# Altium project Nano2.PrjPCB
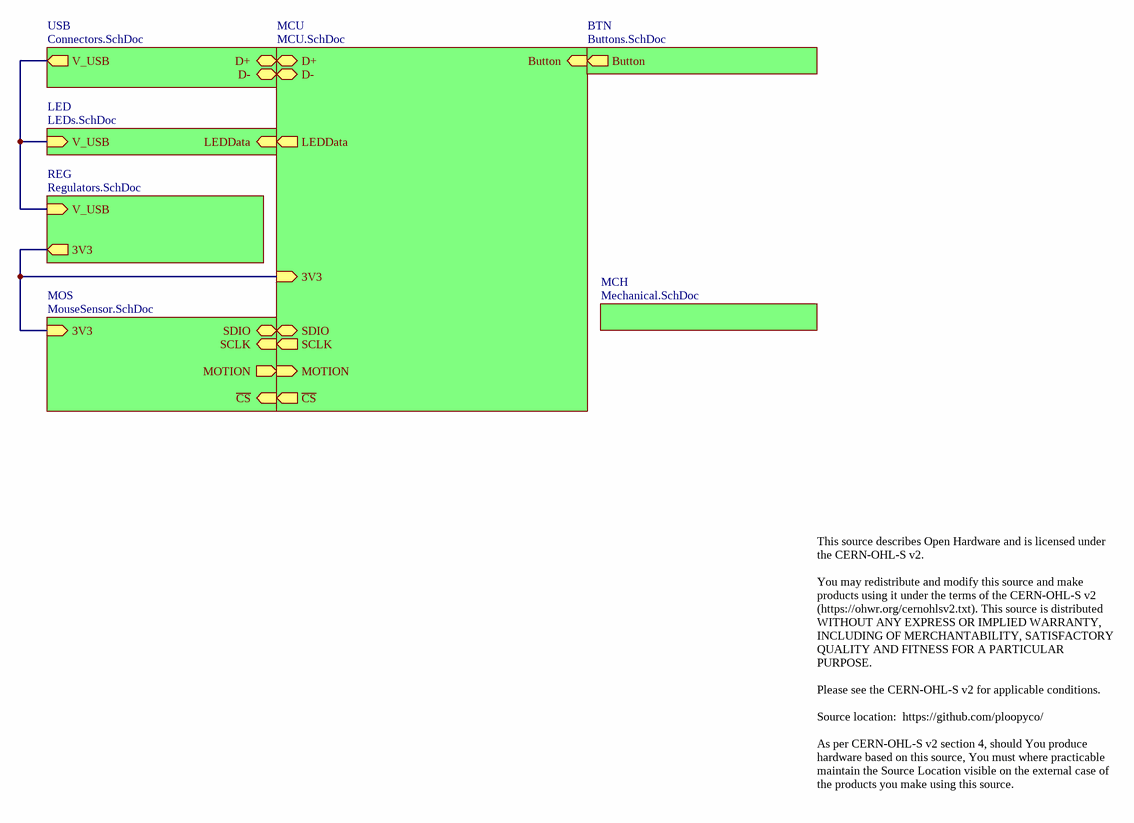
[diagram p0: Nano2.SchDoc]
8 sheets, 60 parts. Net scope: hierarchical (ports join the sheet entries above them; power ports are global).
Board files: Nano2.PcbDoc, Nano2SolderStencil.PcbDoc, Nano2Panel.PcbDoc
Sheets:
  Nano2.SchDoc
    USB = Connectors.SchDoc
    LED = LEDs.SchDoc
    REG = Regulators.SchDoc
    MOS = MouseSensor.SchDoc
    MCU = MCU.SchDoc
    BTN = Buttons.SchDoc
    MCH = Mechanical.SchDoc

## Sheet Nano2.SchDoc
size Letter; CompanyName: Ploopy Corporation; Organization: Ploopy Corporation; Address1: 137-1140 Burnhamthorpe Road W; Address2: Mississauga; Address3: Ontario; Address4: Canada L5C 0A3; DocumentNumber: 1; Revision: R2.003; SheetNumber: 1; SheetTotal: 8

### Sub-sheets
BTN = Buttons.SchDoc: Button (out)
LED = LEDs.SchDoc: V_USB (in), LEDData (in)
MCH = Mechanical.SchDoc: no entries
MCU = MCU.SchDoc: D+ (bidir), D- (bidir), Button (in), LEDData (out), 3V3 (in), SDIO (bidir), SCLK (out), ~{CS} (out), MOTION (in)
MOS = MouseSensor.SchDoc: 3V3 (in), ~{CS} (in), SDIO (bidir), SCLK (in), MOTION (out)
REG = Regulators.SchDoc: 3V3 (out), V_USB (in)
USB = Connectors.SchDoc: D+ (bidir), V_USB (out), D- (bidir)

### Nets
3V3: sheet REG/3V3, sheet MOS/3V3, sheet MCU/3V3
LEDData: sheet LED/LEDData, sheet MCU/LEDData
V_USB: sheet USB/V_USB, sheet LED/V_USB, sheet REG/V_USB
NetR3_2: sheet MOS/SDIO, sheet MCU/SDIO
NetR6_2: sheet USB/D-, sheet MCU/D-
NetR7_2: sheet USB/D+, sheet MCU/D+
NetSW1_A: sheet MCU/Button, sheet BTN/Button
NetU2_A3: sheet MOS/~{CS}, sheet MCU/~{CS}
NetU2_B2: sheet MOS/MOTION, sheet MCU/MOTION
NetU2_D2: sheet MOS/SCLK, sheet MCU/SCLK

### Notes on the sheet
- This source describes Open Hardware and is licensed under the CERN-OHL-S v2.
  You may redistribute and modify this source and make products using it under the terms of the CERN-OHL-S v2 (https://ohwr.org/cernohlsv2.txt). This source is distributed WITHOUT ANY EXPRESS OR IMPLIED WARRANTY, INCLUDING OF MERCHANTABILITY, SATISFACTORY QUALITY AND FITNESS FOR A PARTICULAR PURPOSE.
  Please see the CERN-OHL-S v2 for applicable conditions.
  Source location:  https://github.com/ploopyco/
  As per CERN-OHL-S v2 section 4, should You produce hardware based on this source, You must where practicable maintain the Source Location visible on the external case of the products you make using this source.
- Copyright Ploopy Corporation 2024
- Licensed under the CERN-OHL-S v2
- http://ohwr.org/cernohl
- Title:
- PCB:
- Version:
- Ploopy Corporation
- Mississauga ON L5C 0A3
- 137-1140 Burnhamthorpe Road W
- Date:
- Time:
- Sheet
- of
- Canada

## Sheet Connectors.SchDoc
size Letter; CompanyName: Ploopy Corporation; Organization: Ploopy Corporation; Address1: 137-1140 Burnhamthorpe Road W; Address2: Mississauga; Address3: Ontario; Address4: Canada L5C 0A3; DocumentNumber: 3; Revision: R2.003; SheetNumber: 3; SheetTotal: 8
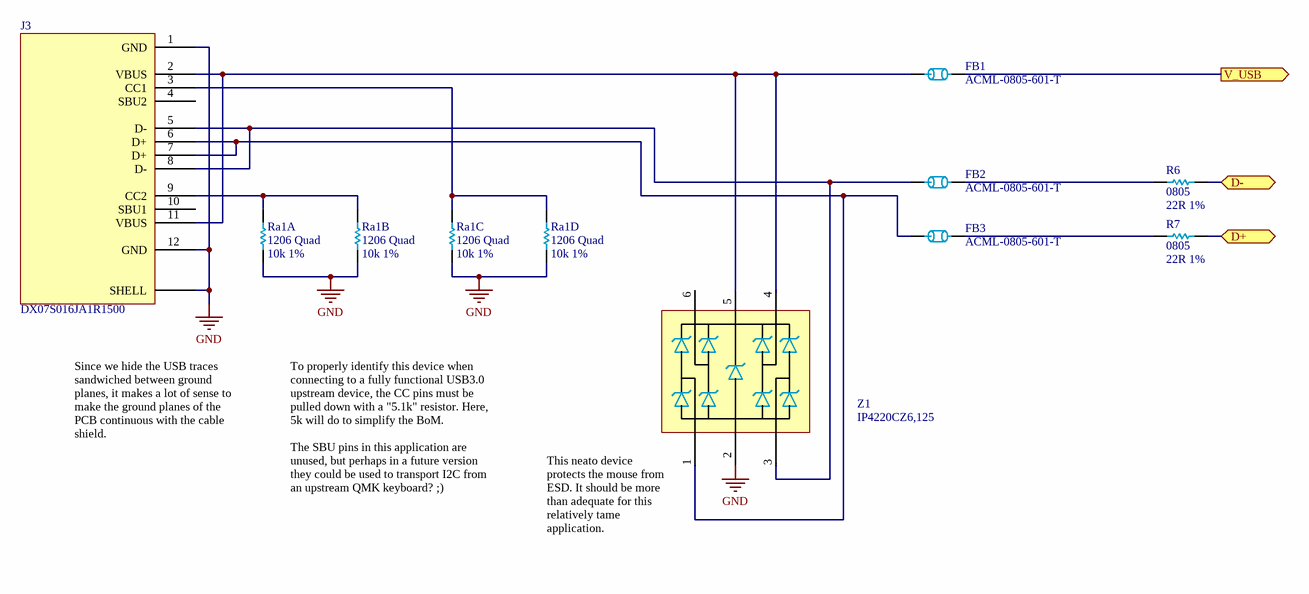
[diagram p1: Connectors.SchDoc]

### Parts
FB1  ACML-0805-601-T  [0805]
FB2  ACML-0805-601-T  [0805]
FB3  ACML-0805-601-T  [0805]
J3  DX07S016JA1R1500  [DX07S016JA1R1500]
R6  0805  value 22R 1%  [0805]
R7  0805  value 22R 1%  [0805]
Ra1  1206 Quad  value 10k 1%  [4x 10k 1% - CAC-80P320X160-8M]  (parts A,B,C,D of 4)
Z1  IP4220CZ6,125  [PESD3V3S4UD - SOT95P275X110-6N]

### Ports
D+ (bidir), D- (bidir), V_USB (out)

### Nets
GND: J3.1(GND) J3.12(GND) J3.SHELL Ra1.1 Ra1.2 Ra1.3 Ra1.4 Z1.2
V_USB: FB1.2 ; port V_USB
NetFB1_1: FB1.1 J3.2(VBUS) J3.11(VBUS) Z1.4 Z1.5
NetFB2_1: FB2.1 J3.5(D-) J3.8(D-) Z1.3
NetFB2_2: FB2.2 R6.1
NetFB3_1: FB3.1 J3.6(D+) J3.7(D+) Z1.1
NetFB3_2: FB3.2 R7.1
NetJ3_3: J3.3(CC1) Ra1.5 Ra1.6
NetJ3_9: J3.9(CC2) Ra1.7 Ra1.8
NetR6_2: R6.2 ; port D-
NetR7_2: R7.2 ; port D+

Not connected (* = marked no-connect by the designer): J3 4(SBU2) 10(SBU1); Z1 6

### Notes on the sheet
- Since we hide the USB traces sandwiched between ground planes, it makes a lot of sense to make the ground planes of the PCB continuous with the cable shield.
- To properly identify this device when connecting to a fully functional USB3.0 upstream device, the CC pins must be pulled down with a "5.1k" resistor. Here, 5k will do to simplify the BoM.
  The SBU pins in this application are unused, but perhaps in a future version they could be used to transport I2C from an upstream QMK keyboard? ;)
- (near Z1) This neato device protects the mouse from ESD. It should be more than adequate for this relatively tame application.
- Copyright Ploopy Corporation 2024
- Licensed under the CERN-OHL-S v2
- http://ohwr.org/cernohl
- Title:
- PCB:
- Version:
- Ploopy Corporation
- Mississauga ON L5C 0A3
- 137-1140 Burnhamthorpe Road W
- Date:
- Time:
- Sheet
- of
- Canada

### Library data of the parts
FB1-FB3 = ACML-0805-601-T: FERRITE BEAD 600 OHM 0805 1LN; PNP-Nzl: 2; PNP-dx: 0; PNP-X: 2.00; PNP-Y: 1.25; PNP-Thk: 0.55; PNP-Lv: 1; PNP-TS: 70; PNP-Type: chi; PNP-FeedType: Tape; PNP-TapeWidth: 8; PNP-dy: 0; PNP-Pt: 0; PNP-W: 0; PNP-Level: 1; PNP-Voff: 0; PNP-PlacePriority: 1; PNP-A: 0; PNP-TapeIndex: 1; PNP-da: 0; Supplier 1: Digi-Key; Supplier Part Number 1: 535-12556-1-ND
J3 = DX07S016JA1R1500: USB-C (USB TYPE-C) USB 2.0 Receptacle Connector 24 (16+8 Dummy) Position Surface Mount, Right Angle; Through Hole; Supplier 1: Digi-Key; Supplier 2: Mouser; Supplier Part Number 1: 670-DX07S016JA1R1500CT-ND; Supplier Part Number 2: 656-DX07S016JA1R1500
R6 R7 = Res 22R 1% 0805: Chip resistor; PNP-Nzl: 2; PNP-dx: 0; PNP-X: 2.00; PNP-Y: 1.25; PNP-Thk: 0.55; PNP-Lv: 1; PNP-TS: 70; PNP-Type: chi; PNP-FeedType: Tape; PNP-TapeWidth: 8; PNP-dy: 0; PNP-Pt: 0; PNP-W: 0; PNP-Level: 1; PNP-Voff: 0; PNP-PlacePriority: 1; PNP-A: 0; PNP-TapeIndex: 1; PNP-da: 0; Supplier 1: Digi-Key; Supplier 2: Arrow; Supplier Part Number 1: RMCF0805FT22R0CT-ND; Supplier Part Number 2: RMCF0805FT22R0
Ra1 = Quad Res 10k 1% 1206: Chip resistor
Z1 = IP4220CZ6,125: TVS DIODE 5.5V 6TSOP (Low capacitance, USB); PNP-Nzl: 2; PNP-dx: 0; PNP-X: 2.9; PNP-Y: 1.3; PNP-A: 270; PNP-Thk: 1; PNP-Lv: 26; PNP-TS: 90; PNP-Type: CHP; PNP-FeedType: Tape; PNP-TapeWidth: 8; PNP-PlacePriority: 3; PNP-dy: 0; PNP-Pt: 0; PNP-W: 0; PNP-Level: 1; PNP-Voff: 0; PNP-TapeIndex: 1; PNP-da: 0

## Sheet LEDs.SchDoc
size Letter; CompanyName: Ploopy Corporation; Organization: Ploopy Corporation; Address1: 137-1140 Burnhamthorpe Road W; Address2: Mississauga; Address3: Ontario; Address4: Canada L5C 0A3; DocumentNumber: 4; Revision: R2.003; SheetNumber: 4; SheetTotal: 8
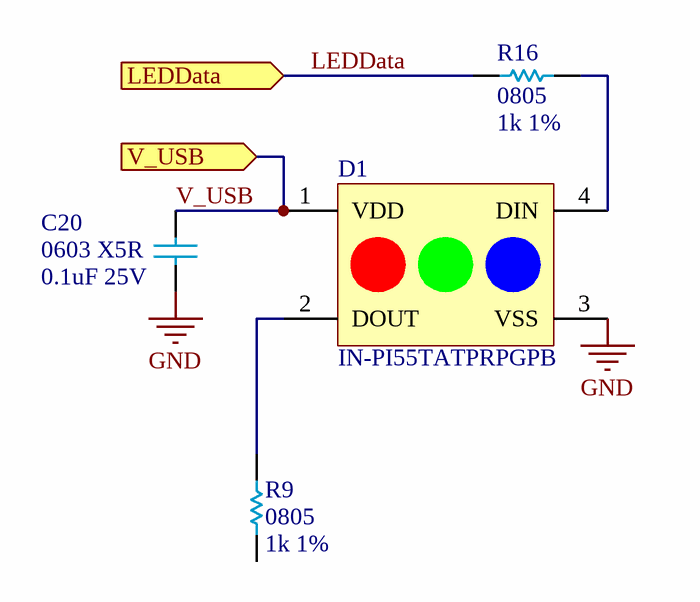
[diagram p2: LEDs.SchDoc]

### Parts
C20  0603 X5R  value 0.1uF 25V  [0603 capacitor - CAPC1608X06N]
D1  IN-PI55TATPRPGPB  [IN-PI55TATPRPGPB]
R9  0805  value 1k 1%  [0805]
R16  0805  value 1k 1%  [0805]

### Ports
LEDData (in), V_USB (in)

### Nets
GND: C20.1 D1.3(VSS)
LEDData: R16.2 ; port LEDData
V_USB: C20.2 D1.1(VDD) ; port V_USB
NetD1_2: D1.2(DOUT) R9.2
NetD1_4: D1.4(DIN) R16.1

Not connected (* = marked no-connect by the designer): R9 1

### Notes on the sheet
- Copyright Ploopy Corporation 2024
- Licensed under the CERN-OHL-S v2
- http://ohwr.org/cernohl
- Title:
- PCB:
- Version:
- Ploopy Corporation
- Mississauga ON L5C 0A3
- 137-1140 Burnhamthorpe Road W
- Date:
- Time:
- Sheet
- of
- Canada

### Library data of the parts
C20 = Cap 0.1uF 25V: 0603, X5R or better; Supplier 1: Digi-Key; Supplier Part Number 1: 1276-6840-2-ND
D1 = IN-PI55TATPRPGPB: ADDRESS LED DISCRETE SERIAL RGB; Supplier 1: Digi-Key; Supplier 2: Arrow; Supplier 3: Mouser; Supplier Part Number 1: 1830-1204-1-ND; Supplier Part Number 2: IN-PI55TATPRPGPB; Supplier Part Number 3: 743-IN-PI55TATPRPGPB
R9 R16 = Res 1k 1% 0805: Chip resistor, 1/8W 100PPM; Supplier 1: Digi-Key; Supplier Part Number 1: RMCF0805FT1K00TR-ND

## Sheet Regulators.SchDoc
size Letter; CompanyName: Ploopy Corporation; Organization: Ploopy Corporation; Address1: 137-1140 Burnhamthorpe Road W; Address2: Mississauga; Address3: Ontario; Address4: Canada L5C 0A3; DocumentNumber: 8; Revision: R2.003; SheetNumber: 8; SheetTotal: 8
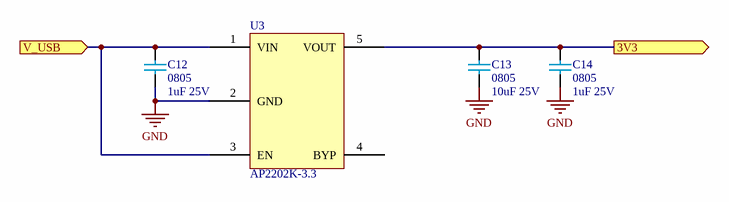
[diagram p3: Regulators.SchDoc]

### Parts
C12  0805  value 1uF 25V  [0805]
C13  0805  value 10uF 25V  [0805]
C14  0805  value 1uF 25V  [0805]
U3  AP2202K-3.3  [AP2202 - SOT95P270X145-5N]

### Ports
3V3 (out), V_USB (in)

### Nets
GND: C12.1 C13.1 C14.1 U3.2(GND)
3V3: C13.2 C14.2 U3.5(VOUT) ; port 3V3
V_USB: C12.2 U3.1(VIN) U3.3(EN) ; port V_USB

Not connected (* = marked no-connect by the designer): U3 4(BYP)

### Notes on the sheet
- Copyright Ploopy Corporation 2024
- Licensed under the CERN-OHL-S v2
- http://ohwr.org/cernohl
- Title:
- PCB:
- Version:
- Ploopy Corporation
- Mississauga ON L5C 0A3
- 137-1140 Burnhamthorpe Road W
- Date:
- Time:
- Sheet
- of
- Canada

### Library data of the parts
C12 C14 = Cap 1uF 25V: 0805, X5R or better; PNP-Nzl: 2; PNP-dx: 0; PNP-Level: 1; PNP-Thk: 1.25; PNP-TS: 70; PNP-Type: chi; PNP-X: 2.00; PNP-FeedType: Tape; PNP-TapeWidth: 8; Supplier 1: Digi-Key; Supplier Part Number 1: 1276-1066-2-ND; Supplier 2: Digi-Key; Supplier Part Number 2: 1276-1066-1-ND; PNP-dy: 0; PNP-Lv: 1; PNP-Pt: 0; PNP-Voff: 0; PNP-W: 0; PNP-Y: 1.25; PNP-A: 0; PNP-PlacePriority: 1; PNP-TapeIndex: 1; PNP-da: 0
C13 = Cap 10uF 25V: 0805, X5R or better; PNP-Nzl: 2; PNP-dx: 0; PNP-X: 2.00; PNP-Y: 1.25; PNP-Lv: 1; PNP-TS: 70; PNP-Type: chi; PNP-FeedType: Tape; PNP-TapeWidth: 8; PNP-dy: 0; PNP-Pt: 0; PNP-W: 0; PNP-Thk: 1.25; PNP-Level: 1; PNP-Voff: 0; PNP-PlacePriority: 1; PNP-A: 0; PNP-TapeIndex: 1; Supplier 1: Mouser; Supplier Part Number 1: 81-GRM21BR61E106KA3L; Supplier 2: Digi-Key; Supplier Part Number 2: 490-5523-1-ND; PNP-da: 0
U3 = AP2202K-3.3: 3.3V 150mA LDO regulator; PNP-Nzl: 2; PNP-dx: 0; PNP-X: 2.9; PNP-Y: 1.3; PNP-A: 90; PNP-Thk: 1; PNP-Lv: 26; PNP-Type: CHP; PNP-FeedType: Tape; PNP-TapeWidth: 8; PNP-PlacePriority: 3; PNP-dy: 0; PNP-Pt: 0; PNP-W: 0; PNP-TS: 90; PNP-Level: 1; PNP-Voff: 0; PNP-TapeIndex: 1; Supplier 1: Mouser; Supplier Part Number 1: 621-AP2202K-3.3TRG1; Supplier 2: Digi-Key; Supplier Part Number 2: AP2202K-3.3TRG1DICT-ND; Supplier 3: Arrow; Supplier Part Number 3: PWagzdsTFFHKE_U17B45SP-NtndBrheJIaI5hB7gHD0ZVywxIBNyoAQstvnyfZZ0; PNP-da: 0

## Sheet MouseSensor.SchDoc
size Letter; CompanyName: Ploopy Corporation; Organization: Ploopy Corporation; Address1: 137-1140 Burnhamthorpe Road W; Address2: Mississauga; Address3: Ontario; Address4: Canada L5C 0A3; DocumentNumber: 7; Revision: R2.003; SheetNumber: 7; SheetTotal: 8
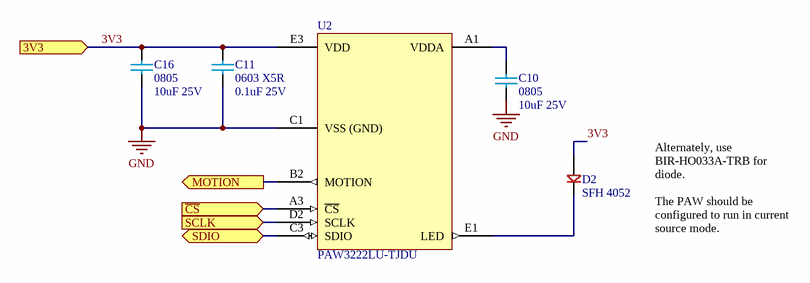
[diagram p4: MouseSensor.SchDoc]

### Parts
C10  0805  value 10uF 25V  [0805]
C11  0603 X5R  value 0.1uF 25V  [0603 capacitor - CAPC1608X06N]
C16  0805  value 10uF 25V  [0805]
D2  SFH 4052  [Osram SFH 4052 - DIOC3216X12M]
U2  PAW3222LU-TJDU  [PAW3222LU-TJDU - BGA15C30P3X5_155X189X72]

### Ports
3V3 (in), MOTION (out), SCLK (in), SDIO (bidir), ~{CS} (in)

### Nets
GND: C10.1 C11.1 C16.1 U2.C1(VSS_(GND))
3V3: C11.2 C16.2 D2.A U2.E3(VDD) ; port 3V3
NetC10_2: C10.2 U2.A1(VDDA)
NetD2_C: D2.C U2.E1(LED)
NetR3_2: U2.C3(SDIO) ; port SDIO
NetU2_A3: U2.A3(~{CS}) ; port ~{CS}
NetU2_B2: U2.B2(MOTION) ; port MOTION
NetU2_D2: U2.D2(SCLK) ; port SCLK

### Notes on the sheet
- Alternately, use BIR-HO033A-TRB for diode.
  The PAW should be configured to run in current source mode.
- Copyright Ploopy Corporation 2024
- Licensed under the CERN-OHL-S v2
- http://ohwr.org/cernohl
- Title:
- PCB:
- Version:
- Ploopy Corporation
- Mississauga ON L5C 0A3
- 137-1140 Burnhamthorpe Road W
- Date:
- Time:
- Sheet
- of
- Canada

### Library data of the parts
C10 C16 = Cap 10uF 25V: as C13 on sheet Regulators; PNP-dy: 0; PNP-Pt: 0; PNP-W: 0; PNP-Thk: 1.25; PNP-Level: 1; PNP-Voff: 0; PNP-PlacePriority: 1; PNP-A: 0; PNP-TapeIndex: 1; Supplier 1: Mouser; Supplier Part Number 1: 81-GRM21BR61E106KA3L; Supplier 2: Digi-Key; Supplier Part Number 2: 490-5523-1-ND; PNP-da: 0
C11 = Cap 0.1uF 25V: 0603, X5R or better; Supplier 1: Digi-Key; Supplier Part Number 1: 1276-6840-2-ND
D2 = SFH 4052: Infrared (IR) Emitter 850nm 1206
U2 = PAW3222LU-TJDU: Ultra Low Power Wireless Mouse Chip

## Sheet MCU.SchDoc
size Tabloid; CompanyName: Ploopy Corporation; Organization: Ploopy Corporation; Address1: 137-1140 Burnhamthorpe Road W; Address2: Mississauga; Address3: Ontario; Address4: Canada L5C 0A3; DocumentNumber: 5; Revision: R2.003; SheetNumber: 5; SheetTotal: 8
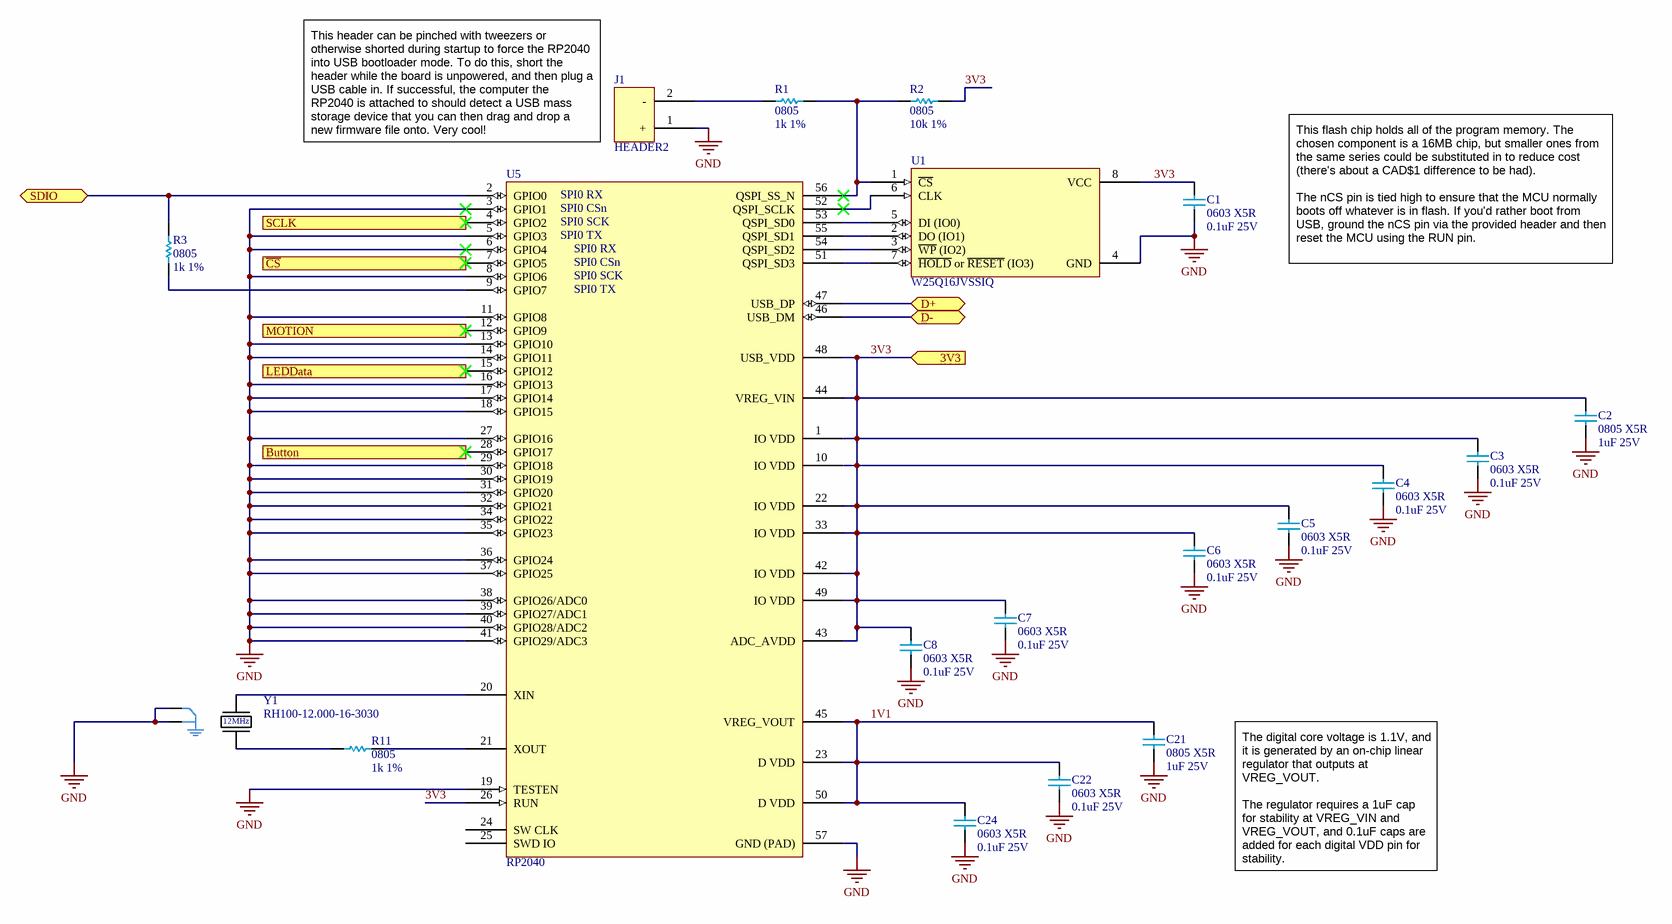
[diagram p5: MCU.SchDoc]

### Parts
C1  0603 X5R  value 0.1uF 25V  [0603 capacitor - CAPC1608X06N]
C2  0805 X5R  value 1uF 25V  [0805 - TALL]
C3  0603 X5R  value 0.1uF 25V  [0603 capacitor - CAPC1608X06N]
C4  0603 X5R  value 0.1uF 25V  [0603 capacitor - CAPC1608X06N]
C5  0603 X5R  value 0.1uF 25V  [0603 capacitor - CAPC1608X06N]
C6  0603 X5R  value 0.1uF 25V  [0603 capacitor - CAPC1608X06N]
C7  0603 X5R  value 0.1uF 25V  [0603 capacitor - CAPC1608X06N]
C8  0603 X5R  value 0.1uF 25V  [0603 capacitor - CAPC1608X06N]
C21  0805 X5R  value 1uF 25V  [0805 - TALL]
C22  0603 X5R  value 0.1uF 25V  [0603 capacitor - CAPC1608X06N]
C24  0603 X5R  value 0.1uF 25V  [0603 capacitor - CAPC1608X06N]
J1  HEADER2  [2x1]
R1  0805  value 1k 1%  [0805]
R2  0805  value 10k 1%  [0805]
R3  0805  value 1k 1%  [0805]
R11  0805  value 1k 1%  [0805]
U1  W25Q16JVSSIQ  [W25Q128JVS - SOIC127P790X216-8M]
U5  RP2040  [RP2040 - QFN40P700X700X90_HS-57M]
Y1  RH100-12.000-16-3030  [RH100-12.000-16-3030]

### Ports
3V3 (in), Button (in), D+ (bidir), D- (bidir), LEDData (out), MOTION (in), SCLK (out), SDIO (bidir), ~{CS} (out)

### Nets
GND: C1.1 C2.1 C3.1 C4.1 C5.1 C6.1 C7.1 C8.1 C21.1 C22.1 C24.1 J1.1(+) U1.4(GND) U5.3(GPIO1) U5.5(GPIO3) U5.6(GPIO4) U5.8(GPIO6) U5.11(GPIO8) U5.13(GPIO10) U5.14(GPIO11) U5.16(GPIO13) U5.17(GPIO14) U5.18(GPIO15) U5.19(TESTEN) U5.27(GPIO16) U5.29(GPIO18) U5.30(GPIO19) U5.31(GPIO20) U5.32(GPIO21) U5.34(GPIO22) U5.35(GPIO23) U5.36(GPIO24) U5.37(GPIO25) U5.38(GPIO26/ADC0) U5.39(GPIO27/ADC1) U5.40(GPIO28/ADC2) U5.41(GPIO29/ADC3) U5.57(GND_(PAD)) Y1.2 Y1.4
1V1: C21.2 C22.2 C24.2 U5.23(D_VDD) U5.45(VREG_VOUT) U5.50(D_VDD)
3V3: C1.2 C2.2 C3.2 C4.2 C5.2 C6.2 C7.2 C8.2 R2.1 U1.8(VCC) U5.1(IO_VDD) U5.10(IO_VDD) U5.22(IO_VDD) U5.26(RUN) U5.33(IO_VDD) U5.42(IO_VDD) U5.43(ADC_AVDD) U5.44(VREG_VIN) U5.48(USB_VDD) U5.49(IO_VDD) ; port 3V3
LEDData: U5.15(GPIO12) ; port LEDData
NetJ1_2: J1.2(-) R1.1
NetR1_2: R1.2 R2.2 U1.1(~{CS}) U5.56(QSPI_SS_N)
NetR3_1: R3.1 U5.9(GPIO7)
NetR3_2: R3.2 U5.2(GPIO0) ; port SDIO
NetR6_2: U5.46(USB_DM) ; port D-
NetR7_2: U5.47(USB_DP) ; port D+
NetR11_1: R11.1 U5.21(XOUT)
NetR11_2: R11.2 Y1.3
NetSW1_A: U5.28(GPIO17) ; port Button
NetU1_2: U1.2(DO_(IO1)) U5.55(QSPI_SD1)
NetU1_3: U1.3(~{WP}_(IO2)) U5.54(QSPI_SD2)
NetU1_5: U1.5(DI_(IO0)) U5.53(QSPI_SD0)
NetU1_6: U1.6(CLK) U5.52(QSPI_SCLK)
NetU1_7: U1.7(~{HOLD}_or_~{RESET}_(IO3)) U5.51(QSPI_SD3)
NetU2_A3: U5.7(GPIO5) ; port ~{CS}
NetU2_B2: U5.12(GPIO9) ; port MOTION
NetU2_D2: U5.4(GPIO2) ; port SCLK
NetU5_20: U5.20(XIN) Y1.1

Not connected (* = marked no-connect by the designer): U5 24(SW_CLK) 25(SWD_IO)

### Notes on the sheet
- This header can be pinched with tweezers or otherwise shorted during startup to force the RP2040 into USB bootloader mode. To do this, short the header while the board is unpowered, and then plug a USB cable in. If successful, the computer the RP2040 is attached to should detect a USB mass storage device that you can then drag and drop a new firmware file onto. Very cool!
- (near U5) SPI0 RX
- (near U5) SPI0 CSn
- (near U5) SPI0 SCK
- (near U5) SPI0 TX
- This flash chip holds all of the program memory. The chosen component is a 16MB chip, but smaller ones from the same series could be substituted in to reduce cost (there's about a CAD$1 difference to be had).
  The nCS pin is tied high to ensure that the MCU normally boots off whatever is in flash. If you'd rather boot from USB, ground the nCS pin via the provided header and then reset the MCU using the RUN pin.
- The digital core voltage is 1.1V, and it is generated by an on-chip linear regulator that outputs at VREG_VOUT.
  The regulator requires a 1uF cap for stability at VREG_VIN and VREG_VOUT, and 0.1uF caps are added for each digital VDD pin for stability.
- Copyright Ploopy Corporation 2024
- Licensed under the CERN-OHL-S v2
- http://ohwr.org/cernohl
- Title:
- PCB:
- Version:
- Ploopy Corporation
- Mississauga ON L5C 0A3
- 137-1140 Burnhamthorpe Road W
- Date:
- Time:
- Sheet
- of
- Canada
- (in symbol RH100-12.000-16-3030) 12MHz

### Library data of the parts
C1 C3-C8 C22 C24 = Cap 0.1uF 25V: 0603, X5R or better; Supplier 1: Digi-Key; Supplier Part Number 1: 1276-6840-2-ND
C2 C21 = Cap 1uF 25V: 0805, X5R or better; Supplier 1: Digi-Key; Supplier Part Number 1: 1276-1066-2-ND; Supplier 2: Digi-Key; Supplier Part Number 2: 1276-1066-1-ND
J1 = HEADER2: 2-pin 0.100" header; Supplier 1: Mouser; Supplier Part Number 1: 855-M20-9990245; Supplier 2: Digi-Key; Supplier Part Number 2: 952-2261-ND
R1 R3 R11 = Res 1k 1% 0805: Chip resistor, 1/8W 100PPM; Supplier 1: Digi-Key; Supplier Part Number 1: RMCF0805FT1K00TR-ND
R2 = Res 10k 1% 0805: Chip resistor; Supplier 1: Digi-Key; Supplier Part Number 1: RMCF0805FT10K0TR-ND
Y1 = RH100-12.000-16-3030: 12MHz Crystal 16pF 100 Ohms 4-SMD, No Lead (3.2mm x 2.5mm); Supplier 1: Digi-Key; Supplier 2: Mouser; Supplier Part Number 1: XC2686CT-ND; Supplier Part Number 2: 520-160-12-30B-AGMT
U1 = W25Q16JVSSIQ: Supplier 1: Digi-Key; Supplier Part Number 1: W25Q16JVSSIQ-ND
U5 = RP2040: Supplier 1: Newark; Supplier Part Number 1: 49AJ8740

## Sheet Buttons.SchDoc
size Letter; CompanyName: Ploopy Corporation; Organization: Ploopy Corporation; Address1: 137-1140 Burnhamthorpe Road W; Address2: Mississauga; Address3: Ontario; Address4: Canada L5C 0A3; DocumentNumber: 2; Revision: R2.003; SheetNumber: 2; SheetTotal: 8
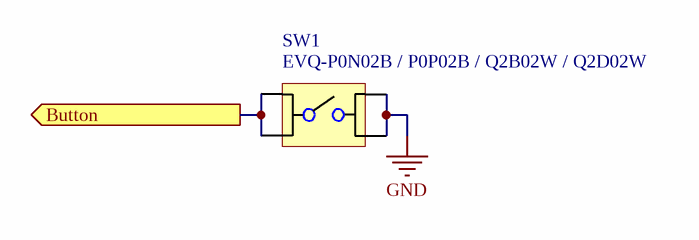
[diagram p6: Buttons.SchDoc]

### Parts
SW1  EVQ-P0N02B / P0P02B / Q2B02W / Q2D02W  [EVQ-Q2D02W Switch]

### Ports
Button (out)

### Nets
GND: SW1.B
NetSW1_A: SW1.A ; port Button

### Notes on the sheet
- Copyright Ploopy Corporation 2024
- Licensed under the CERN-OHL-S v2
- http://ohwr.org/cernohl
- Title:
- PCB:
- Version:
- Ploopy Corporation
- Mississauga ON L5C 0A3
- 137-1140 Burnhamthorpe Road W
- Date:
- Time:
- Sheet
- of
- Canada

### Library data of the parts
SW1 = EVQ-Q2D02W: Tactile Switch SPST-NO Top Actuated Surface Mount

## Sheet Mechanical.SchDoc
size Letter; CompanyName: Ploopy Corporation; Organization: Ploopy Corporation; Address1: 137-1140 Burnhamthorpe Road W; Address2: Mississauga; Address3: Ontario; Address4: Canada L5C 0A3; DocumentNumber: 6; Revision: R2.003; SheetNumber: 6; SheetTotal: 8
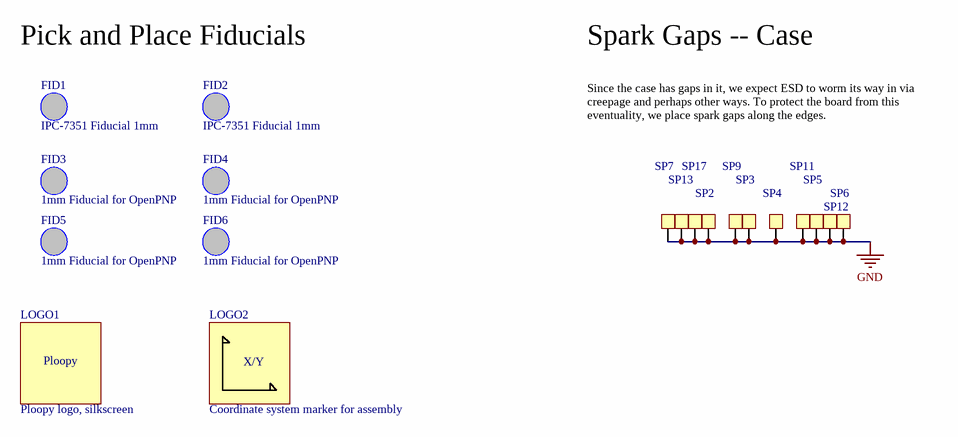
[diagram p7: Mechanical.SchDoc]

### Parts
FID1  IPC-7351 Fiducial 1mm  [FIDUCIAL_1.5]
FID2  IPC-7351 Fiducial 1mm  [FIDUCIAL_1.5]
FID3  1mm Fiducial for OpenPNP  [FIDUCIAL-NEW]
FID4  1mm Fiducial for OpenPNP  [FIDUCIAL-NEW]
FID5  1mm Fiducial for OpenPNP  [FIDUCIAL-NEW]
FID6  1mm Fiducial for OpenPNP  [FIDUCIAL-NEW]
LOGO1  Ploopy logo, silkscreen  [PloopyLogo]  (no BOM)
LOGO2  Coordinate system marker for assembly  [Coordinate System]  (no BOM)
SP2  Spark Gap  [SparkGap]  (value not drawn)  (no BOM)
SP3  Spark Gap  [SparkGap]  (value not drawn)  (no BOM)
SP4  Spark Gap  [SparkGap]  (value not drawn)  (no BOM)
SP5  Spark Gap  [SparkGap]  (value not drawn)  (no BOM)
SP6  Spark Gap  [SparkGap]  (value not drawn)  (no BOM)
SP7  Spark Gap  [SparkGap]  (value not drawn)  (no BOM)
SP9  Spark Gap  [SparkGap]  (value not drawn)  (no BOM)
SP11  Spark Gap  [SparkGap]  (value not drawn)  (no BOM)
SP12  Spark Gap  [SparkGap]  (value not drawn)  (no BOM)
SP13  Spark Gap  [SparkGap]  (value not drawn)  (no BOM)
SP17  Spark Gap  [SparkGap]  (value not drawn)  (no BOM)

### Nets
GND: SP2.1 SP3.1 SP4.1 SP5.1 SP6.1 SP7.1 SP9.1 SP11.1 SP12.1 SP13.1 SP17.1

Not connected (* = marked no-connect by the designer): FID1 1; FID2 1; FID3 1; FID4 1; FID5 1; FID6 1

### Notes on the sheet
- Pick and Place Fiducials
- Spark Gaps -- Case
- Since the case has gaps in it, we expect ESD to worm its way in via creepage and perhaps other ways. To protect the board from this eventuality, we place spark gaps along the edges.
- Copyright Ploopy Corporation 2024
- Licensed under the CERN-OHL-S v2
- http://ohwr.org/cernohl
- Title:
- PCB:
- Version:
- Ploopy Corporation
- Mississauga ON L5C 0A3
- 137-1140 Burnhamthorpe Road W
- Date:
- Time:
- Sheet
- of
- Canada
- (in symbol CoordinateSystem) X/Y
- (in symbol PloopyLogo) Ploopy

### Library data of the parts
FID1 FID2 = FIDUCIAL_1.5: PNP-Nzl: 2; PNP-dx: 0; PNP-X: 4; PNP-A: 1; PNP-Thk: 1.02; PNP-TS: 70; PNP-Type: MARK1; PNP-dy: 0; PNP-Y: 4; PNP-Pt: 0; PNP-W: 0; PNP-Lv: 1; PNP-Level: 1; PNP-Voff: 0; PNP-FeedType: Fiducial; PNP-TapeWidth: 0; PNP-PlacePriority: 0; PNP-TapeIndex: 0; PNP-da: 0
FID3-FID6 = FIDUCIAL_NEW: This fiducial is designed to work with OpenPNP. It presents a circular pattern under the solder mask, to prevent glare issues from messing with the detection.; PNP-Nzl: 2; PNP-dx: 0; PNP-X: 4; PNP-A: 1; PNP-Thk: 1.02; PNP-TS: 70; PNP-Type: MARK1; PNP-dy: 0; PNP-Y: 4; PNP-Pt: 0; PNP-W: 0; PNP-Lv: 1; PNP-Level: 1; PNP-Voff: 0; PNP-FeedType: Fiducial; PNP-TapeWidth: 0; PNP-PlacePriority: 0; PNP-TapeIndex: 0; PNP-da: 0
LOGO1 = PloopyLogo: PNP-Nzl: 2; PNP-dx: 0; PNP-X: 1; PNP-TS: 70; PNP-Type: CHI; PNP-FeedType: Tape; PNP-TapeWidth: 8; PNP-dy: 0; PNP-Y: 1; PNP-A: 0; PNP-Pt: 0; PNP-W: 0; PNP-Thk: 1; PNP-Lv: 1; PNP-Level: 1; PNP-Voff: 0; PNP-PlacePriority: 1; PNP-TapeIndex: 1; PNP-da: 0
LOGO2 = CoordinateSystem
SP2-SP7 SP9 SP11-SP13 SP17 = Spark Gap: Open square pad for spark gapping; PNP-Nzl: 2; PNP-dx: 0; PNP-X: 1; PNP-TS: 70; PNP-Type: CHI; PNP-FeedType: Tape; PNP-TapeWidth: 8; PNP-dy: 0; PNP-Y: 1; PNP-A: 0; PNP-Pt: 0; PNP-W: 0; PNP-Thk: 1; PNP-Lv: 1; PNP-Level: 1; PNP-Voff: 0; PNP-PlacePriority: 1; PNP-TapeIndex: 1; PNP-da: 0

## Nets that join several sheets
GND: Connectors (8 pins), LEDs (C20.1 D1.3), Regulators (C12.1 C13.1 C14.1 U3.2), MouseSensor (C10.1 C11.1 C16.1 U2.C1), MCU (40 pins), Buttons (SW1.B), Mechanical (11 pins)
3V3: Regulators (C13.2 C14.2 U3.5), MouseSensor (C11.2 C16.2 D2.A U2.E3), MCU (20 pins)
LEDData: LEDs (R16.2), MCU (U5.15)
NetR3_2: MouseSensor (U2.C3), MCU (R3.2 U5.2)
NetR6_2: Connectors (R6.2), MCU (U5.46)
NetR7_2: Connectors (R7.2), MCU (U5.47)
NetSW1_A: MCU (U5.28), Buttons (SW1.A)
NetU2_A3: MouseSensor (U2.A3), MCU (U5.7)
NetU2_B2: MouseSensor (U2.B2), MCU (U5.12)
NetU2_D2: MouseSensor (U2.D2), MCU (U5.4)
V_USB: Connectors (FB1.2), LEDs (C20.2 D1.1), Regulators (C12.2 U3.1 U3.3)